# Altium schematic sheet User - User Led's.SchDoc: [23] User - User Led's
size A4; ApprovedBy: Nagy Richard; CheckedBy: Nagy Richard; Author: Nagy Richard; CompanyName: EmbedCore; DrawnBy: Nagy Richard; Engineer: Nagy Richard; Organization: EmbedCore; DocumentNumber: 23; Revision: 1.0; SheetNumber: 23; SheetTotal: 26
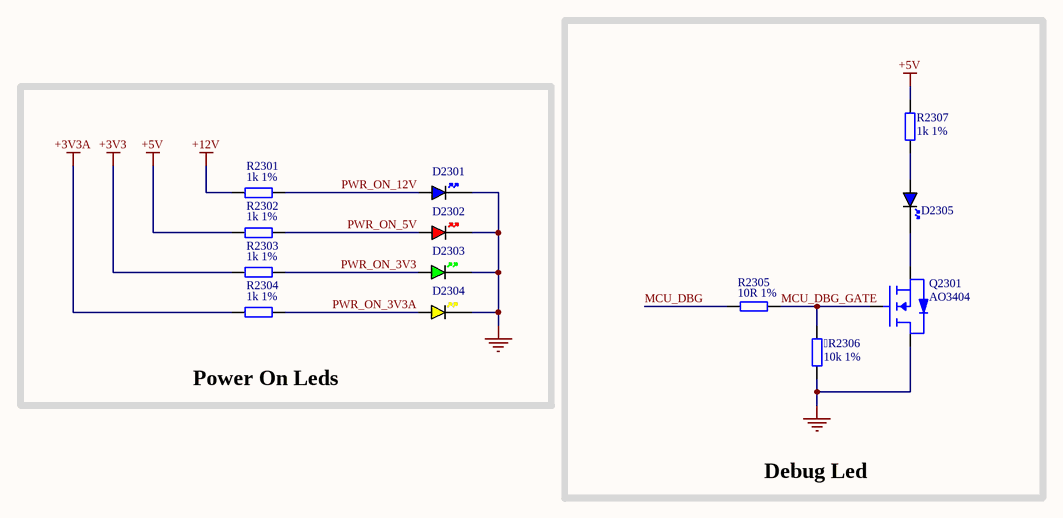
[diagram p0: User - User Led's.SchDoc]

## Parts
R2306  10k 1%  [RES_0402]
D2301  BLUE  [LED_0402_BLUE]  (value not drawn)
D2302  RED  [LED_0402_RED]  (value not drawn)
D2303  GREEN  [LED_0402_GREEN]  (value not drawn)
D2304  YELLOW  [LED_0402_YELLOW]  (value not drawn)
D2305  BLUE  [LED_0402_BLUE]  (value not drawn)
Q2301  AO3404  [SSM3J338R,LF-SOT23-F]
R2301  1k 1%  [RES_0402]
R2302  1k 1%  [RES_0402]
R2303  1k 1%  [RES_0402]
R2304  1k 1%  [RES_0402]
R2305  10R 1%  [RES_0402]
R2307  1k 1%  [RES_0402]

## Blocks framed on the sheet
Debug Led: R2306 D2305 Q2301 R2305 R2307
Power On Leds: D2301-D2304 R2301-R2304

## Nets
+3V3: R2303.1
+3V3A: R2304.1
+5V: R2302.1 R2307.2
+12V: R2301.1
GND: R2306.1 D2301.K D2302.K D2303.K D2304.K Q2301.D
MCU_DBG: R2305.2
MCU_DBG_GATE: R2306.2 Q2301.G R2305.1
PWR_ON_3V3: D2303.A R2303.2
PWR_ON_3V3A: D2304.A R2304.2
PWR_ON_5V: D2302.A R2302.2
PWR_ON_12V: D2301.A R2301.2
NetD2305_A: D2305.A R2307.1
NetD2305_K: D2305.K Q2301.S

## Notes on the sheet
- Title:
- Drawn By:
- Page Contents:
- Checked By:
- Size:
- Date:
- File:
- License:
- Email:
- A4
- Number:
- Time:
- Revision:
- Sheet
- Website:
- of

## Library data of the parts
R2306 = RES_0402: Resistor SMD 0402; Manufacturer: PANASONIC; Manufacturer Part Number: ERJPA2F1002X; Distributor Link: www.lcsc.com; LCSC: C427247
D2301 D2305 = LED_0402_BLUE: LED 0402 BLUE SMD
D2302 = LED_0402_RED: LED 0402 RED SMD
D2303 = LED_0402_GREEN: LED 0402 GREEN SMD
D2304 = LED_0402_YELLOW: LED 0402 YELLOW SMD
Q2301 = 2N7002NXAKR: MOSFET N-Channel Vds=60V Id=300mA with ESD Protection; Manufacturer: TECH PUBLIC; Manufacturer Part Number: AO3404
R2301-R2304 R2307 = RES_0402: Resistor SMD 0402; Manufacturer: PANASONIC; Manufacturer Part Number: ERJPA2J102X; Distributor Link: www.lcsc.com; LCSC: C427210
R2305 = RES_0402: Resistor SMD 0402; Manufacturer: PANASONIC; Manufacturer Part Number: ERJPA2J100X; Distributor Link: www.lcsc.com; LCSC: C427198